# Altium project Master_v1i3.PrjPCB
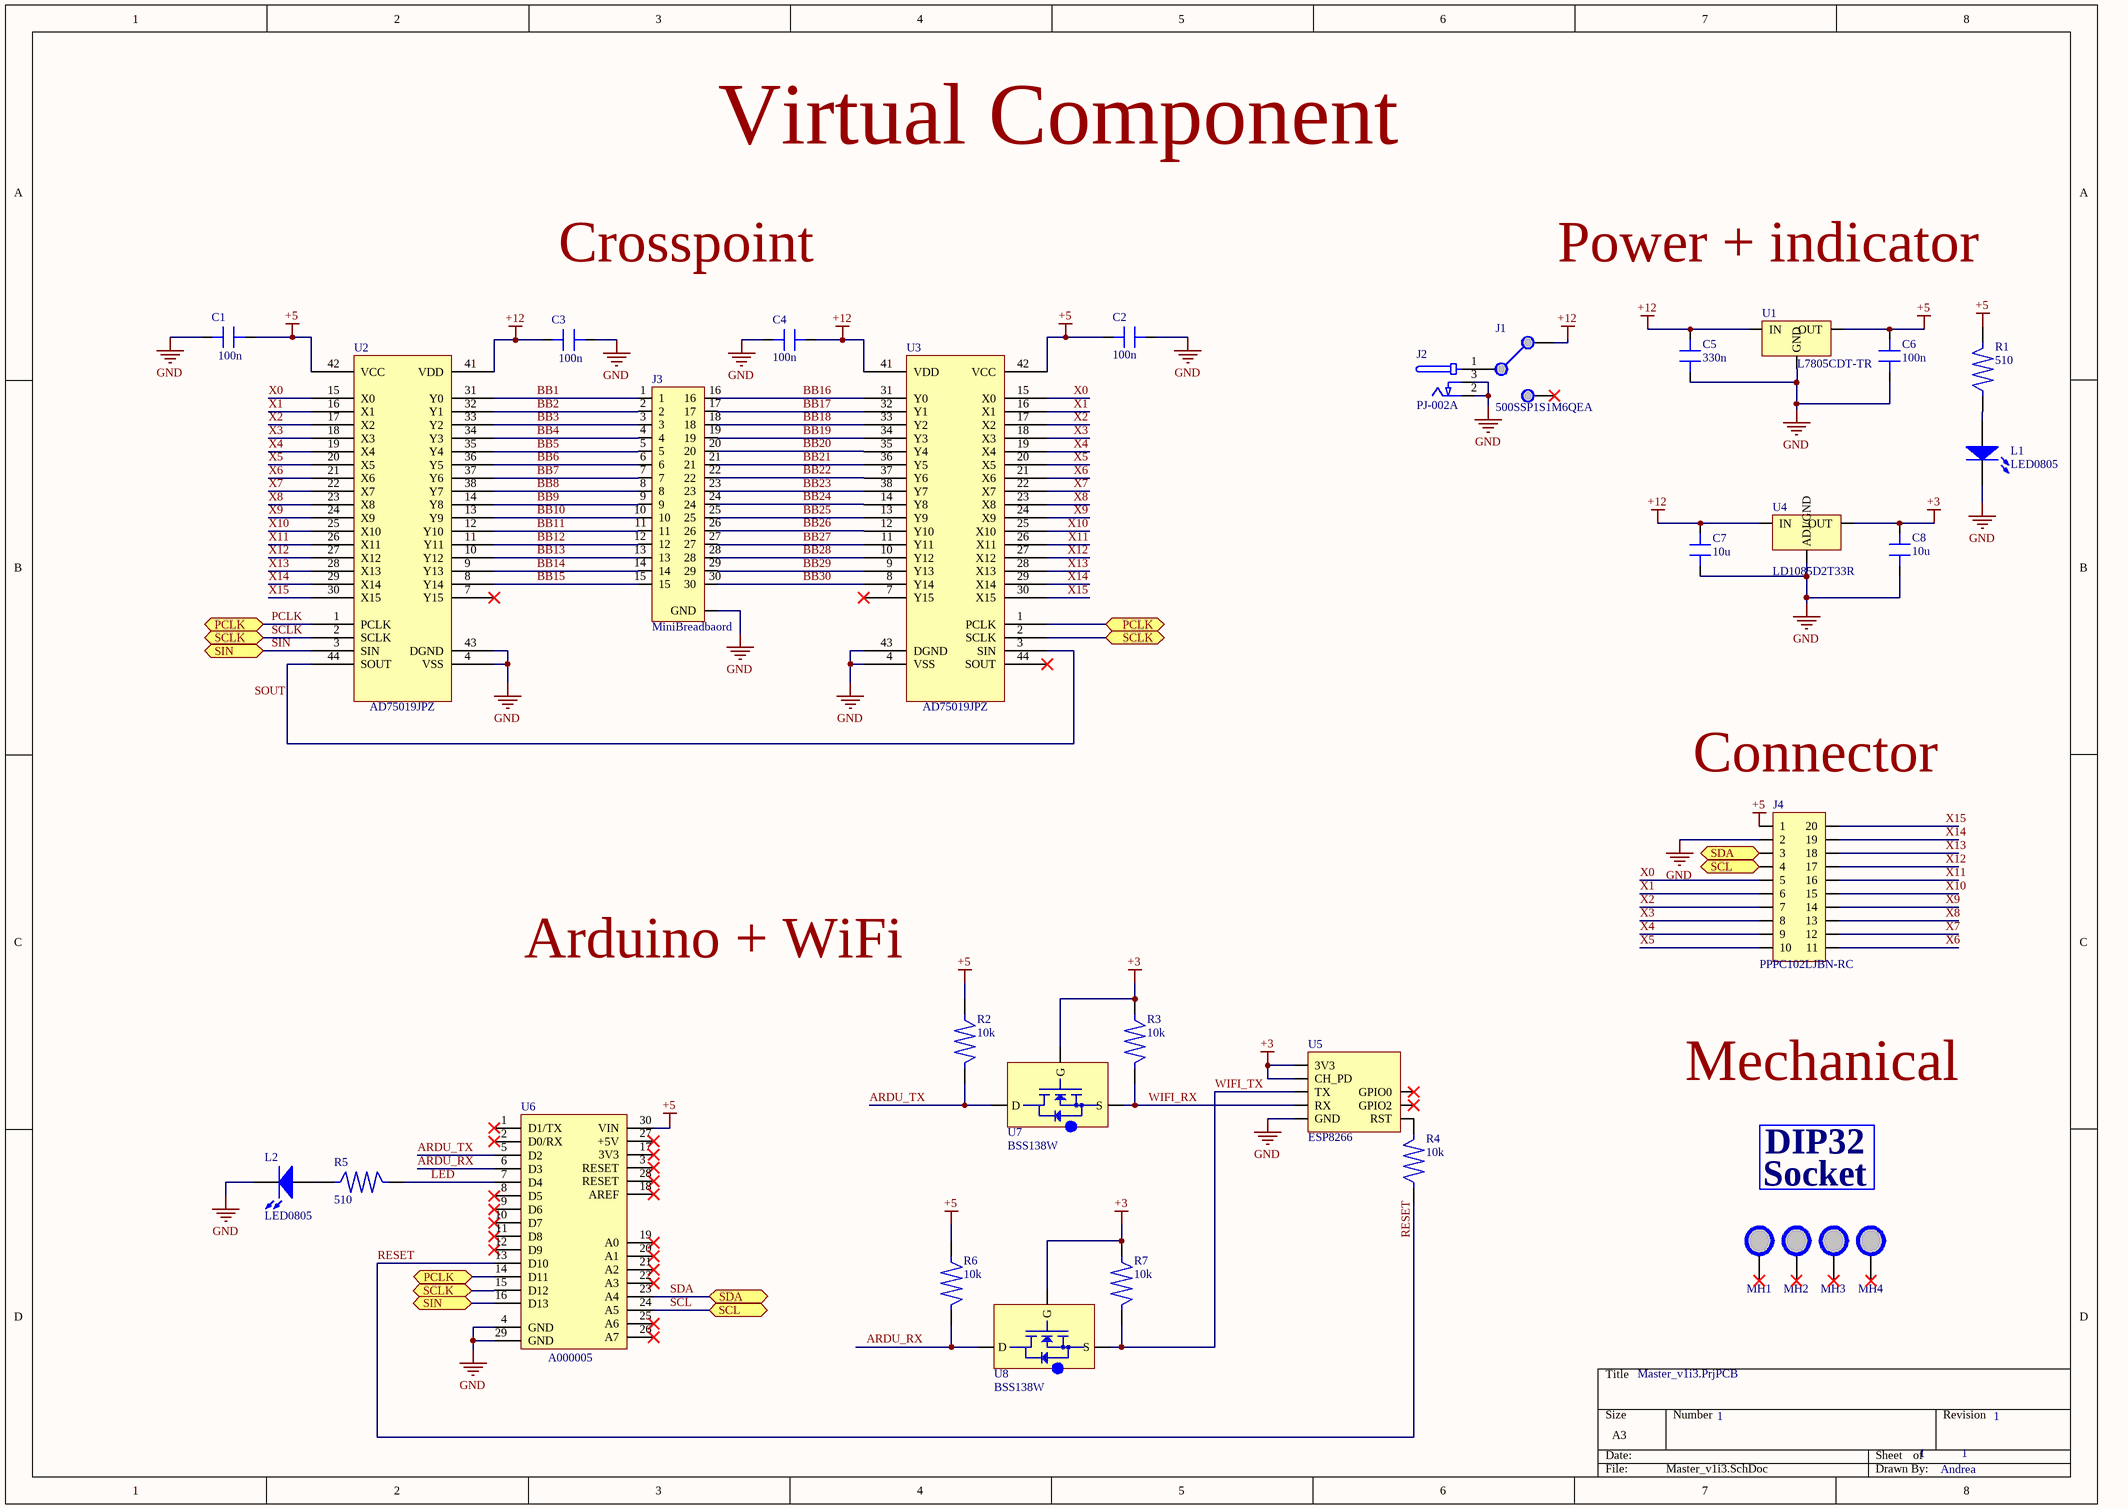
[diagram p0: Master_v1i3.SchDoc]
1 sheet, 34 parts. Net scope: flat (ports and power ports of the same name join across sheets).
Board file: Master_v1i3.PcbDoc

## Sheet Master_v1i3.SchDoc
size A3; Author: Andrea; CompanyName: MAKinteract; Revision: 1; SheetNumber: 1; SheetTotal: 1

### Parts
C1  100n  [C0805]
C2  100n  [C0805]
C3  100n  [C0805]
C4  100n  [C0805]
C5  330n  [C0805]
C6  100n  [C0805]
C7  10u  [C0805]
C8  10u  [C0805]
J1  500SSP1S1M6QEA  [SLIDE SPDT]
J2  PJ-002A  [PJ-002A]
J3  MiniBreadbaord  [MINI_BREADBOARD _HOLE]
J4  PPPC102LJBN-RC  [HDR_FEMALE_10x2x2.54]
L1  LED0805  [LED0805]
L2  LED0805  [LED0805]
MH1  MH 3.2mm NP  [MH3.2mm]  (value not drawn)  (no BOM)
MH2  MH 3.2mm NP  [MH3.2mm]  (value not drawn)  (no BOM)
MH3  MH 3.2mm NP  [MH3.2mm]  (value not drawn)  (no BOM)
MH4  MH 3.2mm NP  [MH3.2mm]  (value not drawn)  (no BOM)
R1  510  [R0805]
R2  10k  [R0805]
R3  10k  [R0805]
R4  10k  [R0805]
R5  510  [R0805]
R6  10k  [R0805]
R7  10k  [R0805]
Socket_for_U6  DIOP 32 socket  (value not drawn)
U1  L7805CDT-TR  [DPAK]
U2  AD75019JPZ  [PLCC44_DIP]
U3  AD75019JPZ  [PLCC44_DIP]
U4  LD1085D2T33R  [D2PAK]
U5  ESP8266  [ESP8266]
U6  A000005  [ARDUINO_NANO]
U7  BSS138W  [SOT-323]
U8  BSS138W  [SOT-323]

### Ports
PCLK (bidir), SCL (bidir), SCLK (bidir), SDA (bidir), SIN (bidir)

### Nets
+3: C8.2 R3.2 R7.2 U4.4(OUT) U5.2(CH_PD) U5.4(3V3) U7.1(G) U8.1(G)
+5: C1.2 C2.2 C6.2 J4.1 R1.2 R2.2 R6.2 U1.3(OUT) U2.42(VCC) U3.42(VCC) U6.30(VIN)
+12: C3.1 C4.1 C5.2 C7.2 J1.1 U1.1(IN) U2.41(VDD) U3.41(VDD) U4.3(IN)
GND: C1.1 C2.1 C3.2 C4.2 C5.1 C6.1 C7.1 C8.1 J2.2 J2.3 J3.31(GND) J4.2 L1.1(C) L2.1(C) U1.4(GND) U2.4(VSS) U2.43(DGND) U3.4(VSS) U3.43(DGND) U4.1(ADJ/GND) U5.8(GND) U6.4(GND) U6.29(GND)
ARDU_RX: R6.1 U6.6(D3) U8.3(D)
ARDU_TX: R2.1 U6.5(D2) U7.3(D)
BB1: J3.1 U2.31(Y0)
BB2: J3.2 U2.32(Y1)
BB3: J3.3 U2.33(Y2)
BB4: J3.4 U2.34(Y3)
BB5: J3.5 U2.35(Y4)
BB6: J3.6 U2.36(Y5)
BB7: J3.7 U2.37(Y6)
BB8: J3.8 U2.38(Y7)
BB9: J3.9 U2.14(Y8)
BB10: J3.10 U2.13(Y9)
BB11: J3.11 U2.12(Y10)
BB12: J3.12 U2.11(Y11)
BB13: J3.13 U2.10(Y12)
BB14: J3.14 U2.9(Y13)
BB15: J3.15 U2.8(Y14)
BB16: J3.16 U3.31(Y0)
BB17: J3.17 U3.32(Y1)
BB18: J3.18 U3.33(Y2)
BB19: J3.19 U3.34(Y3)
BB20: J3.20 U3.35(Y4)
BB21: J3.21 U3.36(Y5)
BB22: J3.22 U3.37(Y6)
BB23: J3.23 U3.38(Y7)
BB24: J3.24 U3.14(Y8)
BB25: J3.25 U3.13(Y9)
BB26: J3.26 U3.12(Y10)
BB27: J3.27 U3.11(Y11)
BB28: J3.28 U3.10(Y12)
BB29: J3.29 U3.9(Y13)
BB30: J3.30 U3.8(Y14)
LED: R5.2 U6.7(D4)
PCLK: U2.1(PCLK) U3.1(PCLK) U6.14(D11) ; port PCLK
RESET: R4.2 U6.13(D10)
SCL: J4.4 U6.24(A5) ; port SCL
SCLK: U2.2(SCLK) U3.2(SCLK) U6.15(D12) ; port SCLK
SDA: J4.3 U6.23(A4) ; port SDA
SIN: U2.3(SIN) U6.16(D13) ; port SIN
SOUT: U2.44(SOUT) U3.3(SIN)
WIFI_RX: R3.1 U5.5(RX) U7.2(S)
WIFI_TX: R7.1 U5.1(TX) U8.2(S)
X0: J4.5 U2.15(X0) U3.15(X0)
X1: J4.6 U2.16(X1) U3.16(X1)
X2: J4.7 U2.17(X2) U3.17(X2)
X3: J4.8 U2.18(X3) U3.18(X3)
X4: J4.9 U2.19(X4) U3.19(X4)
X5: J4.10 U2.20(X5) U3.20(X5)
X6: J4.11 U2.21(X6) U3.21(X6)
X7: J4.12 U2.22(X7) U3.22(X7)
X8: J4.13 U2.23(X8) U3.23(X8)
X9: J4.14 U2.24(X9) U3.24(X9)
X10: J4.15 U2.25(X10) U3.25(X10)
X11: J4.16 U2.26(X11) U3.26(X11)
X12: J4.17 U2.27(X12) U3.27(X12)
X13: J4.18 U2.28(X13) U3.28(X13)
X14: J4.19 U2.29(X14) U3.29(X14)
X15: J4.20 U2.30(X15) U3.30(X15)
NetJ1_2: J1.2 J2.1
NetL1_2: L1.2(A) R1.1
NetL2_2: L2.2(A) R5.1
NetR4_1: R4.1 U5.3(RST)

Not connected (* = marked no-connect by the designer): J1 3*; MH1 1*; MH2 1*; MH3 1*; MH4 1*; U2 5(NC) 6(NC) 7(Y15)* 39(NC) 40(NC); U3 5(NC) 6(NC) 7(Y15)* 39(NC) 40(NC) 44(SOUT)*; U5 6(GPIO0)* 7(GPIO2)*; U6 1(D1/TX)* 2(D0/RX)* 3(RESET)* 8(D5)* 9(D6)* 10(D7)* 11(D8)* 12(D9)* 17(3V3)* 18(AREF)* 19(A0)* 20(A1)* 21(A2)* 22(A3)* 25(A6)* 26(A7)* 27(+5V)* 28(RESET)*

### Notes on the sheet
- Virtual Component
- Crosspoint
- Power + indicator
- (near J4) Connector
- (near R2) Arduino + WiFi
- Mechanical
- (in symbol 4832-6000-CP) DIP32; Socket

### Library data of the parts
C1-C4 C6 = C805_100n
C5 = C805_330n
C7 C8 = C805_10u
J1 = SLIDE SPDT: SWITCH SLIDE SPDT 5A 120V; Manufacturer: E-Switch; Mechanical Life: 30000Cycles; Actuator Material: Nylon,Polyamide; Max Voltage Rating (AC): 250V; Voltage Rating (DC): 28V; Contact Resistance: 10mR; Switch Travel: 2.16mm; Switch Function: On-On; Actuator Length: 4.72mm; Supplier 1: Digi-Key; Manufacturer Part Number: 500SSP1S1M6QEA; Stock 1: 6111; Mount: Through Hole,Brackets; Contact Plating: Silver; Contact Material: Copper,Silver,Copper Alloy; Housing Material: Stainless Steel; Min Operating Temperature: -30°C; Max Operating Temperature: 85°C; Contact Current Rating: 5A; Voltage Rating (AC): 120V; Throw Configuration: SPDT; Package Quantity: 1; Packaging: Bulk; Current Rating: 5A; Max Voltage Rating (DC): 28V; Termination: PC Pin; Electrical Life: 30000Cycles; Orientation: Right Angle; REACH SVHC: Unknown; Lead Free: Lead Free; Flammability Rating: UL94 V-0; ComponentLink1URL: https://datasheet.ciiva.com/16337/500-16337624.pdf; ComponentLink1Description: https://datasheet.ciiva.com/16337/500-16337624.pdf; ComponentLink2URL: https://datasheet.ciiva.com/16174/35500-16174234.pdf; ComponentLink2Description: https://datasheet.ciiva.com/16174/35500-16174234.pdf; ComponentLink3URL: https://datasheet.ciiva.com/2889/t511006d-2889419.pdf; ComponentLink3Description: https://datasheet.ciiva.com/2889/t511006d-2889419.pdf; Supplier Part Number 1: EG2478-ND; Pricing 1: 1=2.93, 10=2.808, 25=2.7484, 50=2.39, 100=2.3303, 250=2.27052, 500=1.912, 1000=1.7925, 5000=1.64313 (USD)
J2 = PJ-002A: PJ-002 Series 2 x 6.5 mm 16 V Right Angle Through Hole Power Jack; Manufacturer: CUI; Gender: Male; Shielding: Unshielded; Current Rating: 2.5A; Voltage Rating: 24V; Insulation Resistance: 50MR; Number of Conductors: 2; Supplier 1: Digi-Key; Manufacturer Part Number: PJ-002A; Stock 1: 133077; Mount: Through Hole; Contact Material: Copper,Copper Alloy; Contact Plating: Nickel,Tin; Housing Colour: Black; Housing Material: Thermoplastic; Colour: Black; Min Operating Temperature: -25°C; Max Operating Temperature: 85°C; Termination: Through Hole; Connector Type: Jack; Packaging: Bulk; Package Quantity: 500; Contact Gender: Male; Orientation: Horizontal; Diameter: 2.1mm; Lead Free: Lead Free; Flammability Rating: UL94 V-0; ComponentLink1URL: http://www.cui.com/product/resource/digikeypdf/pj-002a.pdf; ComponentLink1Description: http://www.cui.com/product/resource/digikeypdf/pj-002a.pdf; ComponentLink2URL: http://www.cui.com/Product/Resource/FuturePDF/PJ-002A.pdf; ComponentLink2Description: http://www.cui.com/Product/Resource/FuturePDF/PJ-002A.pdf; ComponentLink3URL: http://www.mouser.com/ds/2/670/pj-002a-515880.pdf; ComponentLink3Description: http://www.mouser.com/ds/2/670/pj-002a-515880.pdf; Supplier Part Number 1: CP-002A-ND
J3 = 1738132-1: Mini Breadboard; Manufacturer: TE Connectivity AMP; Gender: Male; Supplier 1: Digi-Key; Manufacturer Part Number: 1738132-1; Stock 1: 0; Colour: Natural; ComponentLink1URL: http://www.te.com/commerce/DocumentDelivery/DDEController?Action=srchrtrv&DocNm=1738132&DocType=Customer+Drawing&DocLang=English; ComponentLink1Description: http://www.te.com/commerce/DocumentDelivery/DDEController?Action=srchrtrv&DocNm=1738132&DocType=Customer+Drawing&DocLang=English; Supplier Part Number 1: 1738132-1-ND
J4 = HDR Female 2x10_2.54: CONN FMALE 20POS DL .1" R/A GOLD; Manufacturer: Sullins; Number of Positions: 20; Connector Type: Socket,Header; Pitch: 0.1inch; System: Connector; Supplier 1: Digi-Key; Manufacturer Part Number: PPPC102LJBN-RC; Stock 1: 12126; Mount: Through Hole; Colour: Black; Contact Plating: Gold; Contact Material: Bronze; Housing Colour: Black; Housing Material: Plastic; Package Quantity: 1000; Number of Rows: 2; Packaging: Bulk; Termination: Solder; Length: 25.9mm; Height: 5mm; Row Spacing: 0.1inch; Width: 8.5mm; Lead Free: Lead Free; ComponentLink1URL: http://www.sullinscorp.com/images/10494.pdf; ComponentLink1Description: http://www.sullinscorp.com/images/10494.pdf; ComponentLink2URL: http://sullinscorp.com/drawings/101_P(N)PxCxx2LJBN-RC,_10494-H.pdf; ComponentLink2Description: http://sullinscorp.com/drawings/101_P(N)PxCxx2LJBN-RC,_10494-H.pdf; Supplier Part Number 1: S5563-ND
L1 L2 = LED0805: LED0805 any color
MH1-MH4 = MHNP: Mounting hole 3.2mm non plated
R1 R5 = R0805_510
R2-R4 R6 R7 = R0805_10k
Socket_for_U6 = 4832-6000-CP: SOCKET IC OPEN FRAME 32POS .6"; Manufacturer: 3M; Current Rating: 1A; Voltage Rating (AC): 100V; Insulation Resistance: 5GR; Number of Positions: 32; Connector Type: DIP,Socket; Gender: Female; Pitch: 2.54mm; Row Spacing: 15.24mm; Supplier 1: Digi-Key; Manufacturer Part Number: 4832-6000-CP; Stock 1: 4342; Mount: Through Hole; Contact Material: Bronze; Contact Plating: Nickel,Tin; Housing Material: Polyester; Insulation Material: Polyester; Min Operating Temperature: -25°C; Max Operating Temperature: 85°C; Package Quantity: 2880; Packaging: Rail/Tube; Number of Rows: 2; Termination: Solder; Number of Contacts: 32; Orientation: Straight; Length: 40.51mm; Width: 17.78mm; Depth: 17.78mm; Lead Free: Lead Free; Flammability Rating: UL94 V-0; ComponentLink1URL: https://datasheet.ciiva.com/768/ts1099-768356.pdf; ComponentLink1Description: https://datasheet.ciiva.com/768/ts1099-768356.pdf; ComponentLink2URL: https://datasheet.ciiva.com/14603/70237699-14603099.pdf; ComponentLink2Description: https://datasheet.ciiva.com/14603/70237699-14603099.pdf; Supplier Part Number 1: 3M5470-ND
U1 = L7805CDT-TR: IC REG LDO 5V 1.5A DPAK; Manufacturer: STMicroelectronics; Dropout Voltage: 2V; Number of Outputs: 1; Max Input Voltage: 35V; Min Input Voltage: 7V; Polarity: Positive; Quiescent Current: 8mA; Power Supply Rejection Ratio (PSRR): 62dB; Supplier 1: Digi-Key; Manufacturer Part Number: L7805CDT-TR; Stock 1: 7500; Mount: Surface Mount; Case/Package: TO-252; Number of Pins: 3; Contact Plating: Tin,Matte; Min Operating Temperature: 0°C; Max Operating Temperature: 125°C; Package Quantity: 1; Packaging: Tape and Reel; Max Output Current: 1.5A; Output Voltage: 5V; Output Current: 1.5A; Number of Regulators: 1; Min Output Voltage: 5V; Length: 6.6mm; Height: 2.4mm; Width: 6.2mm; Radiation Hardening: No; Lead Free: Lead Free; ComponentLink1URL: https://datasheet.ciiva.com/2042/cd00000444-2042784.pdf; ComponentLink1Description: https://datasheet.ciiva.com/2042/cd00000444-2042784.pdf; ComponentLink2URL: https://datasheet.ciiva.com/2042/cd00000444-2042785.pdf; ComponentLink2Description: https://datasheet.ciiva.com/2042/cd00000444-2042785.pdf; ComponentLink3URL: https://datasheet.ciiva.com/16357/cd00000444-16357893.pdf; ComponentLink3Description: https://datasheet.ciiva.com/16357/cd00000444-16357893.pdf; ComponentLink4URL: https://datasheet.ciiva.com/4882/cd00000444-4882231.pdf; ComponentLink4Description: https://datasheet.ciiva.com/4882/cd00000444-4882231.pdf; ComponentLink5URL: https://datasheet.ciiva.com/17360/cd00000444-17360220.pdf; ComponentLink5Description: https://datasheet.ciiva.com/17360/cd00000444-17360220.pdf; ComponentLink6URL: https://datasheet.ciiva.com/2042/cd00000444-2042783.pdf; ComponentLink6Description: https://datasheet.ciiva.com/2042/cd00000444-2042783.pdf; ComponentLink7URL: https://datasheet.ciiva.com/26904/l7805cdt-tr-26904768.pdf; ComponentLink7Description: https://datasheet.ciiva.com/26904/l7805cdt-tr-26904768.pdf; Supplier Part Number 1: 497-7255-2-ND
U2 U3 = AD75019JPZ: SWITCH CROSSPOINT 16X16, SMD, 75019; Manufacturer: Analog Devices; Crosspoint Switch Type: Analogue; Control Interface: Serial; Supply Voltage Min: 4.5V; Supply Voltage Max: 5.5V; Digital IC Case: LCC; No. of Pins: 44Pins; SVHC: No SVHC (17-Dec-2015); Supplier 1: Digi-Key; Manufacturer Part Number: AD75019JPZ; Stock 1: 792; Input / Output Configuration: -; Operating Temperature Min: -25°C; Operating Temperature Max: 85°C; Packaging: Each; Product Range: -; MSL: MSL 3 - 168 hours; ComponentLink1URL: https://datasheet.ciiva.com/3036/ad75019-3036466.pdf; ComponentLink1Description: https://datasheet.ciiva.com/3036/ad75019-3036466.pdf; ComponentLink2URL: https://datasheet.ciiva.com/1170/66420-1170438.pdf; ComponentLink2Description: https://datasheet.ciiva.com/1170/66420-1170438.pdf; ComponentLink3URL: https://datasheet.ciiva.com/26824/ad75019jpz-26824058.pdf; ComponentLink3Description: https://datasheet.ciiva.com/26824/ad75019jpz-26824058.pdf; Supplier Part Number 1: AD75019JPZ-ND
U4 = LD1085D2T33R: Fixed LDO Voltage Regulator, 6.3V to 30V, 1.3V Dropout, 3.3Vout, 3Aout, TO-263-3; Manufacturer: STMicroelectronics; Number of Outputs: 1; Max Output Current: 3A; Output Voltage: 3.3V; Min Supply Voltage: 4.9V; Input Bias Current: 5mA; Polarity: Positive; Quiescent Current: 10mA; Max Output Voltage: 3.333V; Accuracy: 1%; Supplier 1: Digi-Key; Manufacturer Part Number: LD1085D2T33R; Stock 1: 5416; Mount: Surface Mount; Case/Package: TO-263; Number of Pins: 3; Weight: 0.01lb; Contact Plating: Tin,Matte; Min Operating Temperature: -40°C; Max Operating Temperature: 125°C; Packaging: Tape and Reel; Max Input Voltage: 30V; Dropout Voltage: 1.3V; Output Current: 3A; Max Supply Voltage: 30V; Package Quantity: 1; Min Input Voltage: 6.3V; Nominal Output Voltage: 3.3V; Number of Regulators: 1; Min Output Voltage: 3.3V; Termination: SMD/SMT; Output Voltage Accuracy: 1%; Length: 10.4mm; Height: 4.6mm; Width: 9.35mm; Radiation Hardening: No; REACH SVHC: No SVHC; Lead Free: Lead Free; ComponentLink1URL: https://datasheet.ciiva.com/16375/cd00001883-16375381.pdf; ComponentLink1Description: https://datasheet.ciiva.com/16375/cd00001883-16375381.pdf; ComponentLink2URL: https://datasheet.ciiva.com/1511/1761309-1511542.pdf; ComponentLink2Description: https://datasheet.ciiva.com/1511/1761309-1511542.pdf; ComponentLink3URL: https://datasheet.ciiva.com/22694/1761309-22694841.pdf; ComponentLink3Description: https://datasheet.ciiva.com/22694/1761309-22694841.pdf; ComponentLink4URL: https://datasheet.ciiva.com/2044/cd00001883-2044187.pdf; ComponentLink4Description: https://datasheet.ciiva.com/2044/cd00001883-2044187.pdf; ComponentLink5URL: https://datasheet.ciiva.com/15111/getdatasheetpartid-65476-15111291.pdf; ComponentLink5Description: https://datasheet.ciiva.com/15111/getdatasheetpartid-65476-15111291.pdf; ComponentLink6URL: https://datasheet.ciiva.com/2044/cd00001883-2044188.pdf; ComponentLink6Description: https://datasheet.ciiva.com/2044/cd00001883-2044188.pdf; ComponentLink7URL: https://datasheet.ciiva.com/2044/cd00001883-2044189.pdf; ComponentLink7Description: https://datasheet.ciiva.com/2044/cd00001883-2044189.pdf; ComponentLink8URL: https://datasheet.ciiva.com/41439/001184676-da-01-en-ic-reg-ldo-3-3-ld1085d2t33r-to-263-3-stm-41439834.pdf; ComponentLink8Description: https://datasheet.ciiva.com/41439/001184676-da-01-en-ic-reg-ldo-3-3-ld1085d2t33r-to-263-3-stm-41439834.pdf; Supplier Part Number 1: 497-1222-6-ND; Pricing 1: 1=1.46, 10=1.305, 100=1.0176, 500=0.84066 (USD)
U5 = WRL-13678: WIFI ESP8266 MOD WIFI TRACE ANT; Manufacturer: SparkFun; Supplier 1: Digi-Key; Manufacturer Part Number: WRL-13678; Stock 1: 1618; ComponentLink1URL: https://nurdspace.nl/images/e/e0/ESP8266_Specifications_English.pdf; ComponentLink1Description: https://nurdspace.nl/images/e/e0/ESP8266_Specifications_English.pdf; Supplier Part Number 1: 1568-1235-ND; Pricing 1: 1=6.95 (USD)
U6 = A000005: ARDUINO   A000005   ATMEGA328, ARDUINO NANO, EVAL BOARD; Evaluation Kit: Yes; Interface: I2C,SPI,USB; Data Bus Width: 8b; Number of Bits: 8; Core Architecture: AVR; Operating Supply Voltage: 20V; Supplier 1: Digi-Key; Manufacturer: Arduino; Manufacturer Part Number: A000005; Stock 1: 0; Weight: 0.02lb; Package Quantity: 1; Packaging: Bulk; Length: 7inch; Height: 0.25inch; Width: 5inch; REACH SVHC: No SVHC; ComponentLink1URL: https://datasheet.ciiva.com/19455/2121148-19455443.pdf; ComponentLink1Description: https://datasheet.ciiva.com/19455/2121148-19455443.pdf; ComponentLink2URL: https://datasheet.ciiva.com/1336/1682238-1336473.pdf; ComponentLink2Description: https://datasheet.ciiva.com/1336/1682238-1336473.pdf; ComponentLink3URL: https://datasheet.ciiva.com/1414/810078-1414124.pdf; ComponentLink3Description: https://datasheet.ciiva.com/1414/810078-1414124.pdf; ComponentLink4URL: https://datasheet.ciiva.com/2398/arduinonanomanual23-2398236.pdf; ComponentLink4Description: https://datasheet.ciiva.com/2398/arduinonanomanual23-2398236.pdf; ComponentLink5URL: https://datasheet.ciiva.com/4926/arduino-arduinoboardnano-188748-4926316.pdf; ComponentLink5Description: https://datasheet.ciiva.com/4926/arduino-arduinoboardnano-188748-4926316.pdf; ComponentLink6URL: https://datasheet.ciiva.com/20168/73-4448-20168542.pdf; ComponentLink6Description: https://datasheet.ciiva.com/20168/73-4448-20168542.pdf; ComponentLink7URL: https://datasheet.ciiva.com/12069/arduino-arduinoboardnano-12069727.pdf; ComponentLink7Description: https://datasheet.ciiva.com/12069/arduino-arduinoboardnano-12069727.pdf; Supplier Part Number 1: 1050-1001-ND
U7 U8 = BSS138W: MOSFET 50V N-CH Logic Level; Manufacturer: Fairchild Semiconductor; Channel Type: N-Channel; Drain-Source On Resistance-Max: 3.5 O; Qg Gate Charge: 1.1 nC; Rated Power Dissipation: 340 mW; Supplier 1: Digi-Key; Manufacturer Part Number: BSS138W; Stock 1: 55420; Drain-to-Source Voltage [Vdss]: 50 V; ComponentLink1URL: https://datasheet.ciiva.com/17170/bss138w-17170739.pdf; ComponentLink1Description: https://datasheet.ciiva.com/17170/bss138w-17170739.pdf; ComponentLink2URL: https://datasheet.ciiva.com/8115/bss138w-8115367.pdf; ComponentLink2Description: https://datasheet.ciiva.com/8115/bss138w-8115367.pdf; ComponentLink3URL: https://datasheet.ciiva.com/15043/bss138w-15043927.pdf; ComponentLink3Description: https://datasheet.ciiva.com/15043/bss138w-15043927.pdf; ComponentLink4URL: https://datasheet.ciiva.com/15043/bss138w-15043928.pdf; ComponentLink4Description: https://datasheet.ciiva.com/15043/bss138w-15043928.pdf; ComponentLink5URL: https://datasheet.ciiva.com/15043/bss138w-15043929.pdf; ComponentLink5Description: https://datasheet.ciiva.com/15043/bss138w-15043929.pdf; ComponentLink6URL: https://datasheet.ciiva.com/8115/bss138w-8115370.pdf; ComponentLink6Description: https://datasheet.ciiva.com/8115/bss138w-8115370.pdf; ComponentLink7URL: https://datasheet.ciiva.com/26146/bss138w-26146843.pdf; ComponentLink7Description: https://datasheet.ciiva.com/26146/bss138w-26146843.pdf; ComponentLink8URL: https://datasheet.ciiva.com/13042/bss138w-91619-13042909.pdf; ComponentLink8Description: https://datasheet.ciiva.com/13042/bss138w-91619-13042909.pdf; Supplier Part Number 1: BSS138WCT-ND